# Altium schematic sheet Vdd.SchDoc
size A
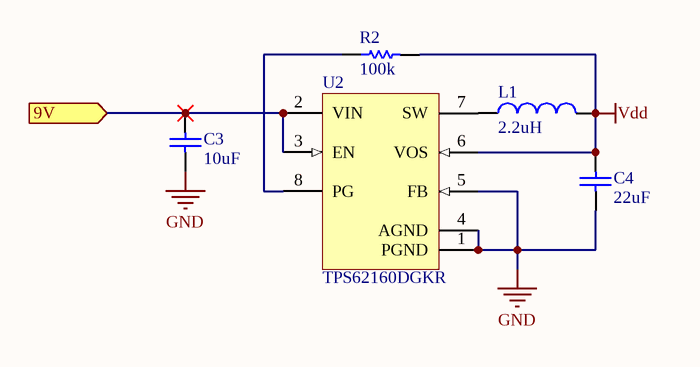
[diagram p0: Vdd.SchDoc]

## Parts
C3  value 10uF  [C1206]  (hidden comment: Cap)
C4  value 22uF  [C1206]  (hidden comment: Cap)
L1  value 2.2uH  [1608[0603]]  (hidden comment: Inductor)
R2  value 100k  [C1206]  (hidden comment: Res1)
U2  TPS62160DGKR  [DGK8_N]

## Ports
9V (in)

## Nets
GND: C3.1 C4.1 U2.1(PGND) U2.4(AGND) U2.5(FB)
Vdd: C4.2 L1.2 R2.2 U2.6(VOS)
9V: C3.2 U2.2(VIN) U2.3(EN) ; port 9V
NetL1_1: L1.1 U2.7(SW)
NetR2_1: R2.1 U2.8(PG)

## Library data of the parts
C3 C4 = Cap: Capacitor; Published: 8-Jun-2000; LatestRevisionDate: 17-Jul-2002; LatestRevisionNote: Re-released for DXP Platform.; PackageReference: RAD-0.3; Publisher: Altium Limited; PackageDescription: Radial Cap, Thru-Hole; 2 Leads; 0.3 in Pin Spacing
L1 = Inductor: Code_IEC: 1005; Published: 8-Jun-2000; LatestRevisionDate: 29-May-2009; LatestRevisionNote: IPC-7351 Footprint Added.; PackageReference: 0402-A; Publisher: Altium Limited; PackageDescription: Chip Inductor; Code_JEITA: 0402
R2 = Res1: Resistor; Published: 8-Jun-2000; LatestRevisionDate: 17-Jul-2002; LatestRevisionNote: Re-released for DXP Platform.; PackageReference: AXIAL-0.3; Publisher: Altium Limited; PackageDescription: Axial Device, Thru-Hole; 2 Leads; 0.3 in Pin Spacing
U2 = TPS62160DGKR: Buck Step Down Regulator with 3 to 17 V Input and 0.9 to 6 V Output, -40 to 85 degC, 8-Pin VSSOP (DGK), Green (RoHS & no Sb/Br); Manufacturer: Texas Instruments; Duty Cycle(Max)(%): 100; Iout(Max)(A): 1; Iq(Typ)(mA): 0.017; Rating: Catalog; SubFamily: Step-Down Regulator; Switch Current Limit(Typ)(A): 1.8; Synchronous Rectification: TRUE; Vin(Max)(V): 17; Vin(Min)(V): 3; Vout(Max)(V): 6; Vout(Min)(V): 0.9; DatasheetVersion: SLVSAM2A; PackageVersion: revE, May-2006; PackageReference: DGK8; PackageDescription: 8-Pin Thin Small Outline Package 3 x 3 mm Body ,0.65 mm Pitch; Supplier 1: Digi-Key; Supplier Part Number 1: TPS62160DGKR-ND; Supplier 2: Newark; Supplier Part Number 2: 92T2383; Supplier 3: Mouser; Supplier Part Number 3: 595-TPS62160DGKR; Eco-Plan: Green (RoHS & no Sb/Br); Regulated Outputs(#): 1; Topology: Buck; Mounting Technology: Surface Mount; Code_JEDEC: MO-187-AA; PartNumber: TPS62160DGKR; ComponentLink1Description: Datasheet; ComponentLink1URL: http://www.ti.com/general/docs/lit/getliterature.tsp?genericPartNumber=TPS62160&fileType=pdf; ComponentLink2Description: Package Specification; ComponentLink2URL: http://www.ti.com/lit/ml/mpds028d/mpds028d.pdf; ComponentLink3Description: URL Link1; ComponentLink3URL: Samples URL:http://www.ti.com/product/tps62160#samples